# EAGLE design anemo5 (EAGLE 6.6.0)
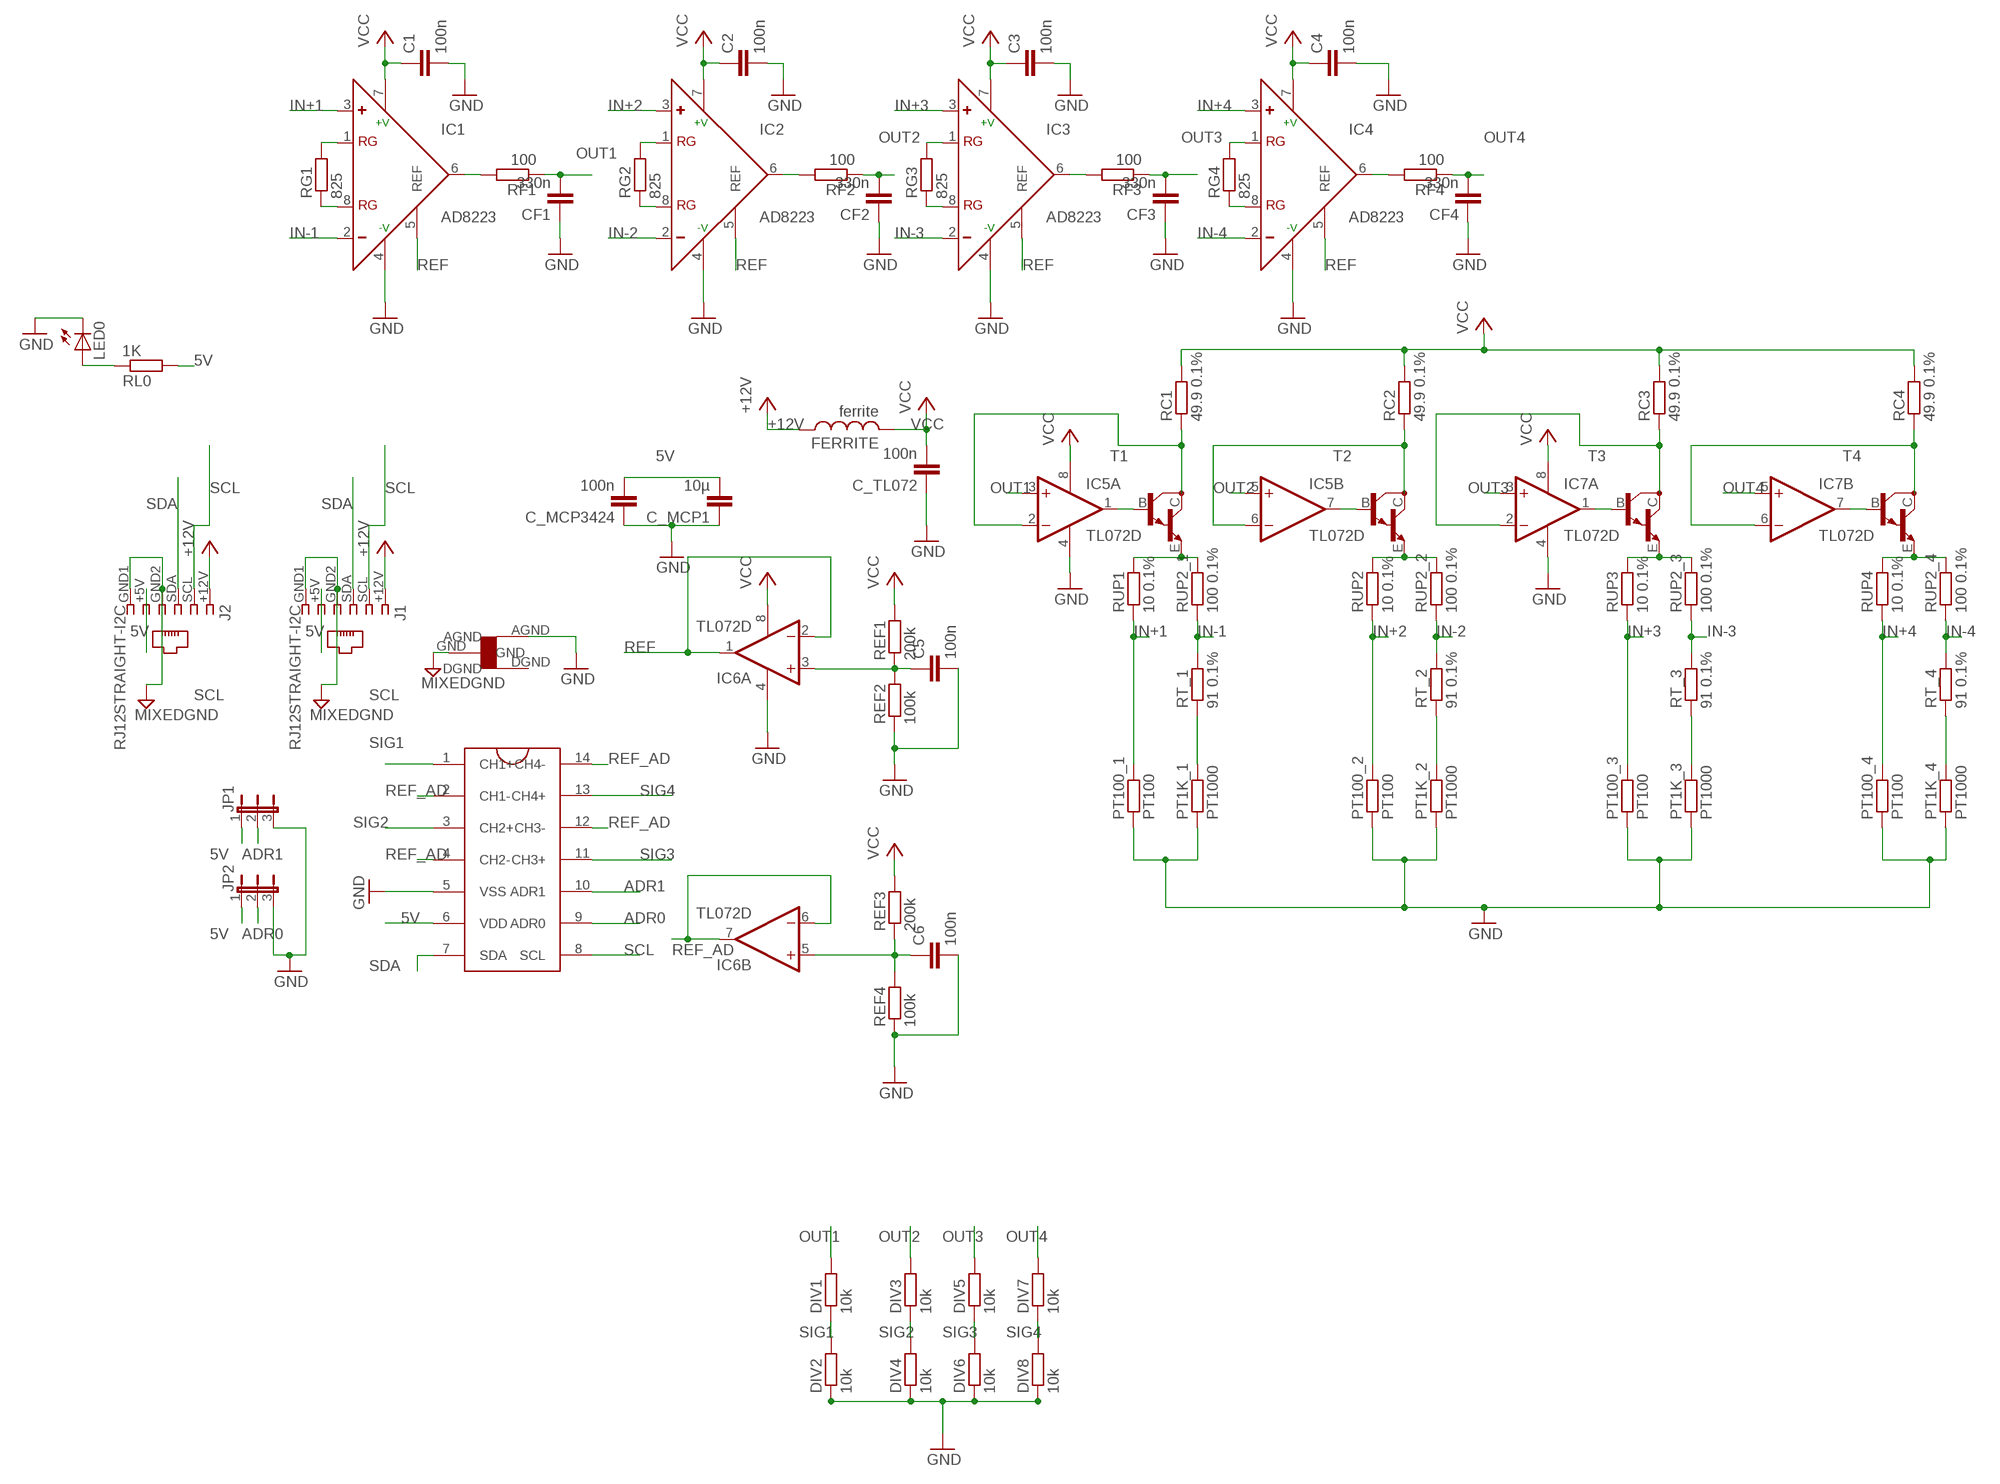
[diagram p0: schematic, sheet 1]

## Parts
C1  100n  C-EUC1206  [C1206]
C2  100n  C-EUC1206  [C1206]
C3  100n  C-EUC1206  [C1206]
C4  100n  C-EUC1206  [C1206]
C5  100n  C-EUC1206  [C1206]
C6  100n  C-EUC1206  [C1206]
C_MCP1  10µ  C-EUC1206  [C1206]
C_MCP3424  100n  C-EUC1206  [C1206]
C_TL072  100n  C-EUC1206  [C1206]
CF1  330n  C-EUC1206  [C1206]
CF2  330n  C-EUC1206  [C1206]
CF3  330n  C-EUC1206  [C1206]
CF4  330n  C-EUC1206  [C1206]
DIV1  10k  R-EU_M1206  [M1206]
DIV2  10k  R-EU_M1206  [M1206]
DIV3  10k  R-EU_M1206  [M1206]
DIV4  10k  R-EU_M1206  [M1206]
DIV5  10k  R-EU_M1206  [M1206]
DIV6  10k  R-EU_M1206  [M1206]
DIV7  10k  R-EU_M1206  [M1206]
DIV8  10k  R-EU_M1206  [M1206]
FERRITE  ferrite  L-USL3216C  [L3216C]
IC1  AD8223  AD620R  [SO8]
IC2  AD8223  AD620R  [SO8]
IC3  AD8223  AD620R  [SO8]
IC4  AD8223  AD620R  [SO8]
IC5  TL072D  [SO08]
IC6  TL072D  [SO08]
IC7  TL072D  [SO08]
J1  RJ12STRAIGHT-I2C  [RJ12-STRAIGHT-I2C]
J2  RJ12STRAIGHT-I2C  [RJ12-STRAIGHT-I2C]
JP1  JP2E  [JP2]
JP2  JP2E  [JP2]
LED0  LED1206  [LED-1206]
PT1K_1  PT1000  R-EU_M1206  [M1206]
PT1K_2  PT1000  R-EU_M1206  [M1206]
PT1K_3  PT1000  R-EU_M1206  [M1206]
PT1K_4  PT1000  R-EU_M1206  [M1206]
PT100_1  PT100  R-EU_M1206  [M1206]
PT100_2  PT100  R-EU_M1206  [M1206]
PT100_3  PT100  R-EU_M1206  [M1206]
PT100_4  PT100  R-EU_M1206  [M1206]
RC1  49.9 0.1%  R-EU_M1206  [M1206]
RC2  49.9 0.1%  R-EU_M1206  [M1206]
RC3  49.9 0.1%  R-EU_M1206  [M1206]
RC4  49.9 0.1%  R-EU_M1206  [M1206]
REF1  200k  R-EU_M1206  [M1206]
REF2  100k  R-EU_M1206  [M1206]
REF3  200k  R-EU_M1206  [M1206]
REF4  100k  R-EU_M1206  [M1206]
RF1  100  R-EU_M1206  [M1206]
RF2  100  R-EU_M1206  [M1206]
RF3  100  R-EU_M1206  [M1206]
RF4  100  R-EU_M1206  [M1206]
RG1  825  R-EU_M1206  [M1206]
RG2  825  R-EU_M1206  [M1206]
RG3  825  R-EU_M1206  [M1206]
RG4  825  R-EU_M1206  [M1206]
RL0  1K  R-EU_M1206  [M1206]
RT_1  91 0.1%  R-EU_M1206  [M1206]
RT_2  91 0.1%  R-EU_M1206  [M1206]
RT_3  91 0.1%  R-EU_M1206  [M1206]
RT_4  91 0.1%  R-EU_M1206  [M1206]
RUP1  10 0.1%  R-EU_M1206  [M1206]
RUP2  10 0.1%  R-EU_M1206  [M1206]
RUP2_1  100 0.1%  R-EU_M1206  [M1206]
RUP2_2  100 0.1%  R-EU_M1206  [M1206]
RUP2_3  100 0.1%  R-EU_M1206  [M1206]
RUP2_4  100 0.1%  R-EU_M1206  [M1206]
RUP3  10 0.1%  R-EU_M1206  [M1206]
RUP4  10 0.1%  R-EU_M1206  [M1206]
T1  MMBTA13LT1-NPN_DARL-SOT23-BEC  [SOT23-BEC]
T2  MMBTA13LT1-NPN_DARL-SOT23-BEC  [SOT23-BEC]
T3  MMBTA13LT1-NPN_DARL-SOT23-BEC  [SOT23-BEC]
T4  MMBTA13LT1-NPN_DARL-SOT23-BEC  [SOT23-BEC]
U$1  MCP3424(SO14)  [14LDSOIC]
U$2  STARGND  [STAR]

## Nets
5V: C_MCP1.2 C_MCP3424.2 J1.+5V J2.+5V JP1.1 JP2.1 RL0.2 U$1.6(VDD)
+12V: FERRITE.1 J1.+12V J2.+12V
ADR0: JP2.2 U$1.9(ADR0)
ADR1: JP1.2 U$1.10(ADR1)
GND [gnd]: C1.2 C2.2 C3.2 C4.2 C5.2 C6.2 C_MCP1.1 C_MCP3424.1 C_TL072.1 CF1.1 CF2.1 CF3.1 CF4.1 DIV2.1 DIV4.1 DIV6.1 DIV8.1 IC1.4(-V) IC2.4(-V) IC3.4(-V) IC4.4(-V) IC5.4(P:V-) IC6.4(P:V-) IC7.4(P:V-) JP1.3 JP2.3 LED0.C PT1K_1.1 PT1K_2.1 PT1K_3.1 PT1K_4.1 PT100_1.1 PT100_2.1 PT100_3.1 PT100_4.1 REF2.1 REF4.1 U$1.5(VSS) U$2.AGND
IN+1: IC1.3(+) PT100_1.2 RUP1.1
IN+2: IC2.3(+) PT100_2.2 RUP2.1
IN+3: IC3.3(+) PT100_3.2 RUP3.1
IN+4: IC4.3(+) PT100_4.2 RUP4.1
IN-1: IC1.2(-) RT_1.2 RUP2_1.1
IN-2: IC2.2(-) RT_2.2 RUP2_2.1
IN-3: IC3.2(-) RT_3.2 RUP2_3.1
IN-4: IC4.2(-) RT_4.2 RUP2_4.1
MIXEDGND [gnd]: J1.GND1 J1.GND2 J2.GND1 J2.GND2 U$2.GND
N$1: IC1.1(RG) RG1.2
N$2: IC1.8(RG) RG1.1
N$3: IC2.8(RG) RG2.1
N$4: IC2.1(RG) RG2.2
N$5: IC3.1(RG) RG3.2
N$6: IC3.8(RG) RG3.1
N$7: IC4.1(RG) RG4.2
N$8: IC4.8(RG) RG4.1
N$9: RUP1.2 RUP2_1.2 T1.E
N$10: C5.1 IC6.3(A:+IN) REF1.1 REF2.2
N$11: RUP2.2 RUP2_2.2 T2.E
N$12: RUP2_3.2 RUP3.2 T3.E
N$13: RUP2_4.2 RUP4.2 T4.E
N$14: LED0.A RL0.1
N$15 [highpower]: IC5.2(A:-IN) RC1.1 T1.C
N$16 [highpower]: IC5.6(B:-IN) RC2.1 T2.C
N$17 [highpower]: IC7.2(A:-IN) RC3.1 T3.C
N$18: IC1.6(OUT) RF1.2
N$19: IC2.6(OUT) RF2.2
N$20: IC3.6(OUT) RF3.2
N$21: IC4.6(OUT) RF4.2
N$22 [highpower]: IC7.6(B:-IN) RC4.1 T4.C
N$23: PT1K_1.2 RT_1.1
N$24: C6.1 IC6.5(B:+IN) REF3.1 REF4.2
N$25: PT1K_2.2 RT_2.1
N$27: PT1K_3.2 RT_3.1
N$29: PT1K_4.2 RT_4.1
OUT1: CF1.2 DIV1.2 IC5.3(A:+IN) RF1.1
OUT1A: IC5.1(A:OUT) T1.B
OUT2: CF2.2 DIV3.2 IC5.5(B:+IN) RF2.1
OUT2A: IC5.7(B:OUT) T2.B
OUT3: CF3.2 DIV5.2 IC7.3(A:+IN) RF3.1
OUT3A: IC7.1(A:OUT) T3.B
OUT4: CF4.2 DIV7.2 IC7.5(B:+IN) RF4.1
OUT4A: IC7.7(B:OUT) T4.B
REF: IC1.5(REF) IC2.5(REF) IC3.5(REF) IC4.5(REF) IC6.1(A:OUT) IC6.2(A:-IN)
REF_AD: IC6.6(B:-IN) IC6.7(B:OUT) U$1.2(CH1-) U$1.4(CH2-) U$1.12(CH3-) U$1.14(CH4-)
SCL: J1.SCL J2.SCL U$1.8(SCL)
SDA: J1.SDA J2.SDA U$1.7(SDA)
SIG1: DIV1.1 DIV2.2 U$1.1(CH1+)
SIG2: DIV3.1 DIV4.2 U$1.3(CH2+)
SIG3: DIV5.1 DIV6.2 U$1.11(CH3+)
SIG4: DIV7.1 DIV8.2 U$1.13(CH4+)
VCC [highpower]: C1.1 C2.1 C3.1 C4.1 C_TL072.2 FERRITE.2 IC1.7(+V) IC2.7(+V) IC3.7(+V) IC4.7(+V) IC5.8(P:V+) IC6.8(P:V+) IC7.8(P:V+) RC1.2 RC2.2 RC3.2 RC4.2 REF1.2 REF3.2
Unconnected: U$2.DGND

## Library data of the parts
C1-C6 C_MCP1 C_MCP3424 C_TL072 CF1-CF4 = rcl:C-EU: CAPACITOR, European symbol
DIV1-DIV8 PT1K_1-PT1K_4 PT100_1-PT100_4 RC1-RC4 REF1-REF4 RF1-RF4 RG1-RG4 RL0 RT_1-RT_4 RUP1 RUP2 RUP2_1-RUP2_4 RUP3 RUP4 = resistor:R-EU_: RESISTOR, European symbol
FERRITE = rcl:L-US: INDUCTOR, American symbol
IC1-IC4 = analog-devices:AD620: Low Cost, Low Power, Instrumentation Amplifier Source: http://www.analog.com/UploadedFiles/Data_Sheets/37793330023930AD620_e.pdf; MPN: AD620AR; OC_FARNELL: 1464424; OC_NEWARK: 05F7109
IC5-IC7 = linear:TL072: OP AMP
J1 J2 = lpatiny:RJ12: CORCOM Modular RJ Jacks No Shield Source: www.tycoelectronics.com .. ENG_DS_1654001_1099_RJ_L_0507.pdf
JP1 JP2 = jumper:JP2E: JUMPER
LED0 = SparkFun:LED: LEDs Standard schematic elements and footprints for 5mm, 3mm, 1206, and 0603 sized LEDs. 5mm - Spark Fun Electronics SKU : COM-00529 (and others)
T1-T4 = transistor:*-NPN_DARL-: NPN Darlington Transistor
U$1 = mcp3424:MCP3424(SO14)
U$2 = lpatiny:STARGND

## Net classes
0 default: width 0.61 mm
1 gnd: width 0.61 mm
2 highpower: width 0.813 mm

## Board
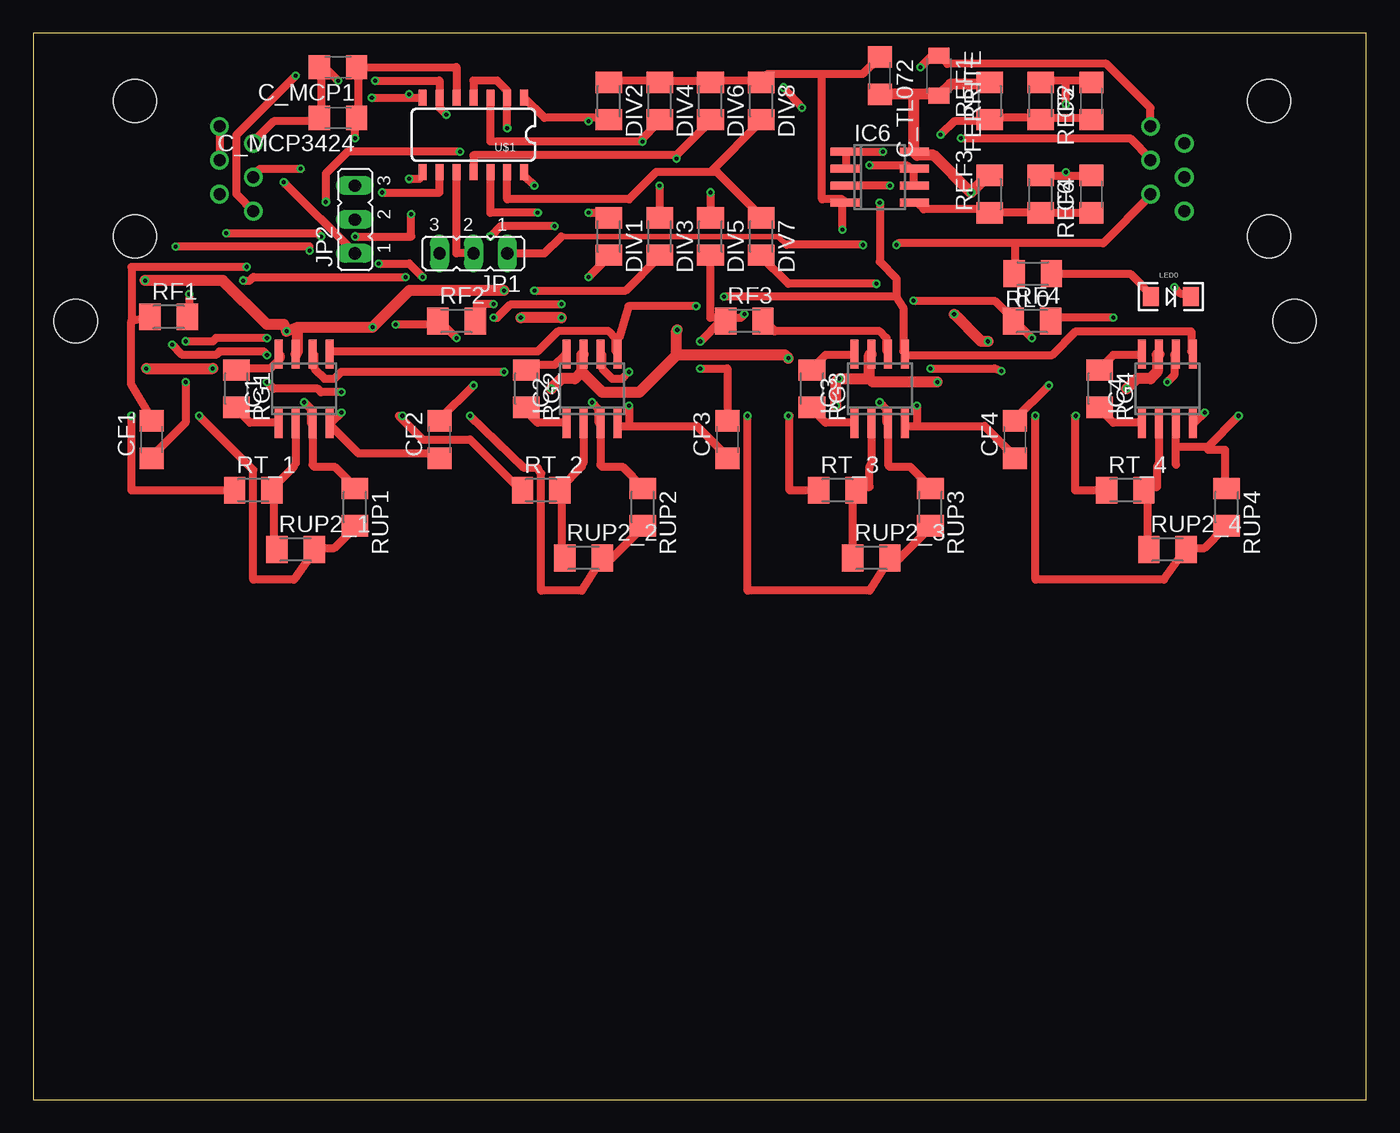
[diagram p1: board, top side]
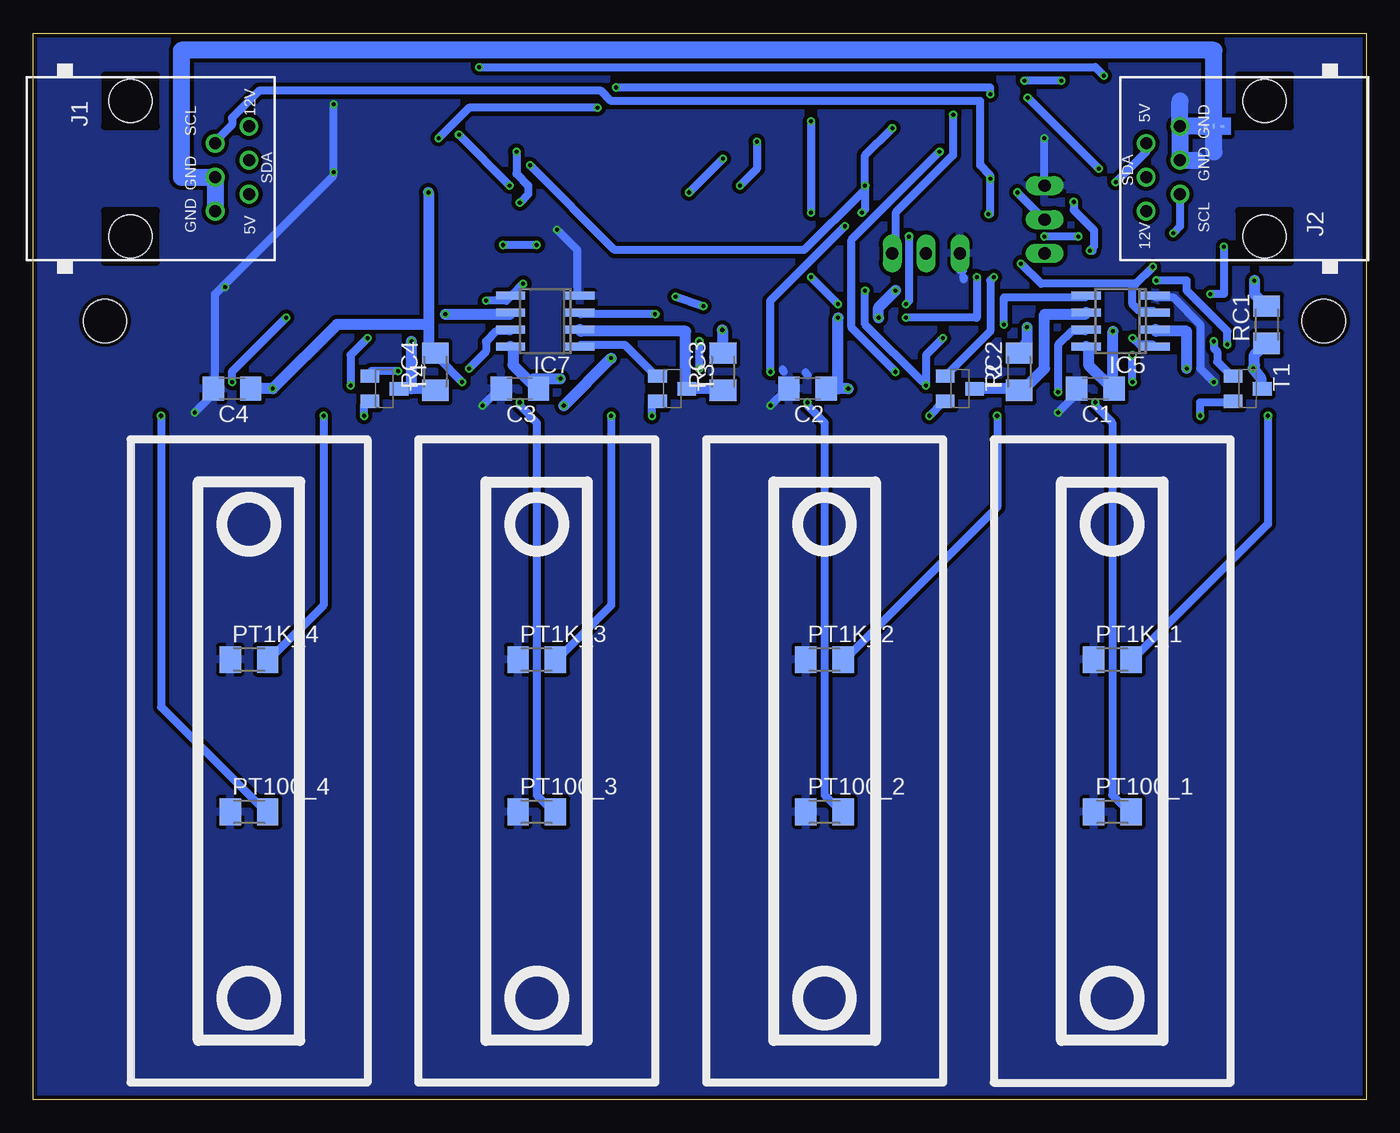
[diagram p2: board, bottom side, seen from below]

Size 100 x 80 mm. Coordinates in mm from the lower left corner, seen from the top.
Outline: 0,0 100,0 100,80 0,80 0,0
Copper layers (1*16): Top 0.035mm / dielectric 1.5mm / Bottom 0.035mm
Design rules "Fusion_eagle_rule_v1.1 *": minimum track width 6mil, minimum drill 12mil, track to track 10mil, track to pad 10mil, pad to pad 10mil, via to via 10mil, smd to smd 0mil, copper to edge 10mil, drill to drill 10mil, minimum pad ring 10mil, minimum via ring 6mil, stop-mask expansion 2mil, vias tented up to drill 100mil, thermal gap 10mil
Holes 3.25 mm at 3.17,58.42 94.61,58.42
vRestrict: area -2.5,-1.3 to 102.9,50.8

### Footprints (pad centres in the part's own frame; a part is rotated, then mirrored left to right if it is on the bottom)
C1206 = smd 1.6 x 1.8: 1 -1.4,0; 2 1.4,0
M1206 = smd 1.6 x 2: 1 -1.4,0; 2 1.4,0
L3216C = smd 1.2 x 1.6: 1 -1.5,0; 2 1.5,0
SO8 = smd 0.6 x 2.2: 1 -1.905,-2.6; 2 -0.635,-2.6; 3 0.635,-2.6; 4 1.905,-2.6; 5 1.905,2.6; 6 0.635,2.6; 7 -0.635,2.6; 8 -1.905,2.6
SO08 = smd 0.6 x 2.2: 1 -1.905,-2.6; 2 -0.635,-2.6; 3 0.635,-2.6; 4 1.905,-2.6; 5 1.905,2.6; 6 0.635,2.6; 7 -0.635,2.6; 8 -1.905,2.6
RJ12-STRAIGHT-I2C = drill 0.9 pad 1.4: +5V 1.905,8.89; +12V -3.175,8.89; GND1 3.175,6.35; GND2 0.635,6.35; SCL -1.905,6.35; SDA -0.635,8.89 | hole 3.251: -5.08,0; 5.08,0
JP2 = drill 0.914 long: 1 -2.54,0; 2 0,0; 3 2.54,0
LED-1206 = smd 1.2 x 1.4: A -1.5,0; C 1.5,0
SOT23-BEC = smd 1 x 1.4: B -0.95,-1.1; C 0,1.1; E 0.95,-1.1
14LDSOIC = smd 1.2 x 0.6: 1 -2.8,3.81; 2 -2.8,2.54; 3 -2.8,1.27; 4 -2.8,0; 5 -2.8,-1.27; 6 -2.8,-2.54; 7 -2.8,-3.81; 8 2.8,-3.81; 9 2.8,-2.54; 10 2.8,-1.27; 11 2.8,0; 12 2.8,1.27; 13 2.8,2.54; 14 2.8,3.81
STAR = smd 0.152 x 0.305: AGND 0.635,-0.635; DGND 0.635,0.635 | smd 0.305 x 0.152: GND 0.635,0

### Placement (x,y rotation side)
C1  20.32,53.34 180 bottom
C2  41.91,53.34 180 bottom
C3  63.5,53.34 180 bottom
C4  85.09,53.34 180 bottom
C5  79.38,74.93 90 top
C6  79.38,67.94 90 top
C_MCP1  22.86,77.47 180 top
C_MCP3424  22.86,73.66 180 top
C_TL072  63.5,76.83 270 top
CF1  8.89,49.53 90 top
CF2  30.48,49.53 90 top
CF3  52.07,49.53 90 top
CF4  73.66,49.53 90 top
DIV1  43.18,64.77 270 top
DIV2  43.18,74.93 270 top
DIV3  46.99,64.77 270 top
DIV4  46.99,74.93 270 top
DIV5  50.8,64.77 270 top
DIV6  50.8,74.93 270 top
DIV7  54.61,64.77 270 top
DIV8  54.61,74.93 270 top
FERRITE  67.94,76.83 270 top
IC1  20.32,53.34 0 top
IC2  41.91,53.34 0 top
IC3  63.5,53.34 0 top
IC4  85.09,53.34 0 top
IC5  18.41,58.42 90 bottom
IC6  63.5,69.22 270 top
IC7  61.59,58.42 90 bottom
J1  92.71,69.85 270 bottom
J2  7.62,69.85 90 bottom
JP1  33.02,63.5 180 top
JP2  24.13,66.04 90 top
LED0  85.34,60.25 0 top
PT1K_1  19.05,33.02 0 bottom
PT1K_2  40.64,33.02 0 bottom
PT1K_3  62.23,33.02 0 bottom
PT1K_4  83.82,33.02 0 bottom
PT100_1  19.05,21.59 0 bottom
PT100_2  40.64,21.59 0 bottom
PT100_3  62.23,21.59 0 bottom
PT100_4  83.82,21.59 0 bottom
RC1  7.47,58.14 90 bottom
RC2  26.04,54.61 90 bottom
RC3  48.26,54.61 90 bottom
RC4  69.85,54.61 90 bottom
REF1  71.75,74.93 90 top
REF2  75.56,74.93 270 top
REF3  71.75,67.94 90 top
REF4  75.56,67.94 270 top
RF1  10.16,58.72 0 top
RF2  31.75,58.42 0 top
RF3  53.34,58.42 0 top
RF4  74.93,58.42 0 top
RG1  15.24,53.34 270 top
RG2  36.98,53.34 270 top
RG3  58.42,53.34 270 top
RG4  80.01,53.34 270 top
RL0  74.98,61.98 180 top
RT_1  16.51,45.72 0 top
RT_2  38.1,45.72 0 top
RT_3  60.33,45.72 0 top
RT_4  81.92,45.72 0 top
RUP1  24.13,44.45 270 top
RUP2  45.72,44.45 270 top
RUP2_1  19.68,41.27 0 top
RUP2_2  41.27,40.64 0 top
RUP2_3  62.87,40.64 0 top
RUP2_4  85.09,41.27 0 top
RUP3  67.31,44.45 270 top
RUP4  89.53,44.45 270 top
T1  8.89,53.34 270 bottom
T2  30.48,53.34 270 bottom
T3  52.07,53.34 270 bottom
T4  73.66,53.34 270 bottom
U$1  33.02,72.39 270 top
U$2  11.43,73.66 270 bottom

### Tracks (layer width: path | path; a pad name or v marks a point on that pad's centre or on a via)
5V  (via drill 0.3)
  Top 0.406: 56.52,64.14 55.88,64.77 39.62,64.77
  Top 0.61: v25.65,76.45 30.48,76.45 U$1.6 30.48,74.42 v30.99,73.91 | v22.86,76.45 21.84,77.47 C_MCP1.2 21.59,77.22 21.59,73.66 C_MCP3424.2 21.34,73.41 18.03,73.41 16.51,71.88 J2.+5V | v18.8,68.83 JP2.1 | 39.62,64.77 38.35,63.5 JP1.1 | J1.+5V 83.82,67.82 80.26,64.26 73.66,64.26 | 73.66,64.26 64.9,64.26 v64.77,64.14 | v62.23,64.14 56.52,64.14 | 73.66,64.26 73.66,61.98 RL0.2
  Bottom 0.61: v22.86,76.45 v25.65,76.45 | v18.8,68.83 16.51,71.12 J2.+5V | JP1.1 35.31,63.75 35.31,66.55 30.99,70.87 v30.99,73.91 | v64.77,64.14 v62.23,64.14
+12V  (via drill 0.3)
  Top 0.61: J1.+12V 83.82,74.42 80.52,77.72 68.58,77.72 68.07,78.23 FERRITE.1 67.82,78.23 67.31,78.23 v66.55,77.47 | v19.68,76.83 15.24,72.39 15.24,67.94 J2.+12V
  Bottom 0.61: v66.55,77.47 20.32,77.47 v19.68,76.83
ADR0  (via drill 0.3)
  Top 0.61: U$1.9 30.48,68.07 v26.16,68.07
  Bottom 0.61: JP2.2 v26.16,68.07
ADR1
  Top 0.61: U$1.10 31.75,63.5 JP1.2
GND  (via drill 0.3)
  Top 0.61: DIV2.1 43.18,76.45 46.99,76.45 DIV4.1 47.24,76.45 50.8,76.45 DIV6.1 51.05,76.45 54.36,76.45 DIV8.1 54.61,76.45 55.12,76.96 59.18,76.96 | 59.18,76.96 62.23,76.96 C_TL072.1 | 66.29,50.55 65.53,50.55 IC3.4 | 66.29,50.55 71.37,50.55 73.66,48.26 CF4.1 | 44.7,50.55 43.94,50.55 IC2.4 | 44.7,50.55 49.78,50.55 52.07,48.26 CF3.1 | CF2.1 30.48,48.26 30.23,48.51 24.38,48.51 22.35,50.55 IC1.4 22.35,50.8 v23.11,51.56 | 77.47,76.45 79.25,76.45 C5.2 | 77.47,76.45 75.69,76.45 REF2.1 | 77.47,69.34 75.69,69.34 REF4.1 | 77.47,69.34 79.25,69.34 C6.2 | v77.47,74.68 77.47,76.45 | v77.47,69.6 77.47,69.34 | U$1.5 31.75,77.47 C_MCP1.1 24.38,77.22 24.38,73.66 C_MCP3424.1 24.13,73.41 v24.13,72.14 | v11.43,53.85 11.43,50.8 8.89,48.26 CF1.1 | v60.71,65.28 60.71,67.31 IC6.4 60.71,67.56 59.18,67.56 59.18,76.96 | v44.7,52.07 44.7,50.55 | v66.29,52.07 66.29,50.55 | v87.88,51.56 87.12,50.8 IC4.4 | v85.6,60.96 86.11,60.45 86.61,60.45 LED0.C
  Bottom 0.61: v77.47,74.68 v77.47,69.6 77.47,69.34 85.72,61.09 | v11.43,53.85 12.45,54.86 12.45,58.17 14.48,60.2 15.75,60.2 IC5.4 | v60.71,65.28 59.18,63.75 59.18,60.45 IC7.4 | JP2.3 v24.13,72.14 | 85.72,61.09 86.36,60.45 86.36,53.34 C4.2 86.61,53.09 86.61,52.83 v87.88,51.56 | v23.11,51.56 21.84,52.83 21.84,53.34 C1.2 | v44.7,52.07 43.43,53.34 C2.2 43.18,53.34 | v66.29,52.07 65.02,53.34 C3.2 | 41.91,54.36 42.06,54.58 | 43.69,54.61 43.79,54.8 | v85.6,60.96 85.72,61.09 | 30.48,62.74 JP1.3 30.23,62.23 30.48,62.23 | 30.23,61.72 30.2,61.55
  Bottom 1.27: 11.43,71.12 11.43,73.03 U$2.AGND 13.97,73.03 | 13.97,73.03 13.97,74.93 | 13.97,73.03 13.97,70.48 12.7,70.48
  pour Bottom (isolate 0.305): -0.03,80.01 99.69,80.01 99.69,0 0,-0.03
IN+1  (via drill 0.3)
  Top 0.61: v20.32,52.32 20.83,51.82 20.83,50.8 IC1.3 20.95,47.62 21.08,47.5 22.61,47.5 24.13,45.97 RUP1.1
  Bottom 0.61: v20.32,52.32 20.32,52.07 19.05,50.8 19.05,22.86 17.78,21.59 PT100_1.2
IN+2  (via drill 0.3)
  Top 0.61: v41.91,52.32 42.42,51.82 42.42,50.8 IC2.3 42.55,47.62 42.67,47.5 44.2,47.5 45.72,45.97 RUP2.1
  Bottom 0.61: v41.91,52.32 41.91,52.07 40.64,50.8 40.64,22.86 39.37,21.59 PT100_2.2
IN+3  (via drill 0.3)
  Top 0.61: v63.5,52.32 64.01,51.82 64.01,50.8 IC3.3 64.14,47.62 64.26,47.5 65.79,47.5 67.31,45.97 RUP3.1
  Bottom 0.61: v63.5,52.32 63.5,52.07 62.23,50.8 62.23,22.86 60.96,21.59 PT100_3.2
IN+4  (via drill 0.3)
  Top 0.61: 85.72,47.62 85.72,49.02 | 85.72,49.02 IC4.3 | 88.14,49.02 v90.42,51.31 | 85.72,49.02 88.14,49.02 | RUP4.1 89.41,45.97 89.41,48.77 88.14,48.77 88.14,49.02
  Bottom 0.61: v90.42,51.31 90.42,29.46 82.55,21.59 PT100_4.2
IN-1
  Top 0.61: IC1.2 19.68,47.76 19.56,47.5 18.03,45.97 RT_1.2 18.03,45.72 18.03,41.4 RUP2_1.1
IN-2
  Top 0.61: IC2.2 41.27,47.76 41.15,47.5 39.62,45.97 RT_2.2 39.62,45.72 39.62,40.64 RUP2_2.1
IN-3
  Top 0.61: IC3.2 62.87,47.76 62.74,47.5 62.74,45.97 61.72,45.97 RT_3.2 61.47,45.72 RUP2_3.1
IN-4
  Top 0.61: IC4.2 84.45,47.76 84.33,47.5 84.33,45.97 83.57,45.97 RT_4.2 83.57,45.72 83.57,41.4 RUP2_4.1
MIXEDGND
  Top 0.61: J2.GND1 J2.GND2
  Bottom 1.27: J1.GND1 J1.GND2 88.9,69.22 88.9,78.74 11.43,78.74 U$2.GND J2.GND1 J2.GND2
N$1
  Top 0.61: RG1.2 15.24,51.82 16.26,50.8 18.29,50.8 IC1.1
N$2
  Top 0.61: RG1.1 15.24,54.86 17.78,54.86 18.54,55.63 18.54,55.88 IC1.8
N$3
  Top 0.61: RG2.1 36.83,54.86 37.08,55.12 39.12,55.12 39.88,55.88 IC2.8
N$4
  Top 0.61: RG2.2 36.83,51.82 37.85,50.8 39.88,50.8 IC2.1
N$5
  Top 0.61: RG3.2 58.42,51.82 59.44,50.8 61.47,50.8 IC3.1
N$6
  Top 0.61: RG3.1 58.42,54.86 59.44,55.88 61.47,55.88 IC3.8
N$7
  Top 0.61: RG4.2 80.01,51.82 81.03,50.8 83.06,50.8 IC4.1
N$8
  Top 0.61: RG4.1 80.01,54.86 81.03,55.88 83.06,55.88 IC4.8
N$9  (via drill 0.3)
  Top 0.61: v12.45,51.31 16.51,47.24 16.51,39.01 19.56,39.01 21.08,41.15 RUP2_1.2 21.34,41.4 22.61,41.4 24.13,42.93 RUP1.2
  Bottom 0.61: v12.45,51.31 12.45,52.32 10.16,52.32 T1.E
N$10  (via drill 0.3)
  Top 0.61: C5.1 79.25,73.66 75.69,73.66 REF2.2 75.44,73.66 71.88,73.66 REF1.1 71.63,73.41 69.09,73.41 v68.07,72.39 | v64.26,68.58 IC6.3
  Bottom 0.61: v68.07,72.39 v64.26,68.58
N$11  (via drill 0.3)
  Top 0.61: v32.77,51.31 36.83,47.4 37.85,47.4 38.1,46.99 38.1,38.2 41.15,38.2 RUP2_2.2 43.43,40.64 45.72,42.93 RUP2.2
  Bottom 0.61: v32.77,51.31 31.75,52.32 T2.E
N$12  (via drill 0.3)
  Top 0.61: v53.59,51.31 53.59,38.2 62.74,38.2 RUP2_3.2 65.02,40.64 67.31,42.93 RUP3.2
  Bottom 0.61: v53.59,51.31 53.59,52.07 53.34,52.32 T3.E
N$13  (via drill 0.3)
  Top 0.61: v75.18,51.31 75.18,39.01 84.84,39.01 86.36,41.15 RUP2_4.2 86.61,41.4 87.88,41.4 89.41,42.93 RUP4.2
  Bottom 0.61: v75.18,51.31 75.18,52.07 74.93,52.32 T4.E
N$14
  Top 0.61: RL0.1 82.3,61.98 83.82,60.45 LED0.A
N$15  (via drill 0.3)
  Top 0.813: v8.48,54.86 v13.46,54.86
  Bottom 0.813: v13.46,54.86 13.46,57.66 15.75,57.66 IC5.2 | T1.C 7.87,53.59 7.87,54.1 v8.48,54.86 8.38,55.12 8.38,55.88 7.62,56.64 RC1.1
N$16
  Bottom 0.813: T2.C 26.16,53.34 RC2.1 25.65,53.34 24.13,54.86 24.13,58.93 21.08,58.93 IC5.6
N$17
  Bottom 0.813: RC3.1 48.26,53.34 T3.C 51.05,53.59 51.05,57.66 58.93,57.66 IC7.2
N$18  (via drill 0.3)
  Top 0.61: v11.68,60.45 11.68,58.42 RF1.2 | v32,71.12 23.57,71.12 21.95,69.49 v21.95,67.36 | v35.31,54.61 23.11,54.61 22.61,54.1 21.84,54.1 21.08,54.86 21.08,55.88 IC1.6 | v20.73,63.7 20.73,64.01 v10.67,64.01
  Bottom 0.61: v32,71.12 38.61,64.52 38.61,57.91 v35.31,54.61 | 20.52,63.7 v20.73,63.7 20.42,64.01 20.42,65.23 21.95,66.75 v21.95,67.36 | v10.67,64.01 10.67,60.45 v11.68,60.45
N$19  (via drill 0.3)
  Top 0.61: v34.54,59.69 33.27,59.69 33.27,58.42 RF2.2 | v34.29,64.77 35.05,65.53 v39.12,65.53 | v44.7,54.61 44.2,54.1 43.43,54.1 42.67,54.86 42.67,55.88 IC2.6
  Bottom 0.61: v34.54,59.69 34.29,59.94 v34.29,64.77 | v39.12,65.53 44.7,59.94 v44.7,54.61
N$20
  Top 0.61: RF3.2 54.86,58.42 55.63,57.66 63.5,57.66 64.01,57.15 64.01,56.13 IC3.6
N$21  (via drill 0.3)
  Top 0.61: v81.03,58.67 76.71,58.67 76.45,58.42 RF4.2 | v85.09,53.85 85.6,54.36 85.6,55.88 IC4.6
  Bottom 0.61: v81.03,58.67 85.09,54.61 v85.09,53.85
N$22  (via drill 0.3)
  Top 0.813: v69.09,58.93 71.12,56.9 v71.63,56.9
  Bottom 0.406: 64.26,58.93 IC7.6
  Bottom 0.813: 71.63,53.34 69.85,53.34 RC4.1 | 71.63,53.34 T4.C | v69.09,58.93 64.26,58.93 | 71.63,53.34 v71.63,56.9
N$23  (via drill 0.3)
  Top 0.61: v7.37,51.31 7.37,45.72 RT_1.1
  Bottom 0.61: v7.37,51.31 7.37,43.18 17.53,33.02 PT1K_1.2
N$24
  Top 0.61: C6.1 79.25,66.55 75.69,66.55 REF4.2 75.44,66.55 71.88,66.55 REF3.1 71.63,66.8 66.8,66.8 66.29,67.31 IC6.5
N$25  (via drill 0.3)
  Top 0.61: 27.43,51.31 27.56,51.18 | 27.56,51.18 29.21,49.53 32.77,49.53 36.58,45.72 RT_2.1 | v27.69,51.31 27.56,51.18
  Bottom 0.61: v27.69,51.31 27.69,44.45 39.12,33.02 PT1K_2.2
N$27  (via drill 0.3)
  Top 0.61: RT_3.1 56.74,45.72 56.74,51.31 v56.64,51.31
  Bottom 0.61: v56.64,51.31 56.64,37.08 60.71,33.02 PT1K_3.2
N$29  (via drill 0.3)
  Top 0.61: RT_4.1 78.18,45.72 78.18,51.31 v78.23,51.31
  Bottom 0.61: v78.23,51.31 78.23,37.08 82.3,33.02 PT1K_4.2
OUT1  (via drill 0.3)
  Top 0.61: RF1.1 7.37,58.42 | 7.37,58.42 7.32,58.27 7.32,53.7 8.89,51.05 CF1.2 | v41.66,61.72 43.18,63.25 DIV1.2 | v39.62,59.69 35.81,59.69 34.8,58.67 v34.54,58.67 | v29.21,61.72 28.19,62.74 v25.91,62.74 | 7.37,58.42 7.37,62.48 v16,62.48
  Bottom 0.61: v39.62,59.69 v41.66,61.72 | v34.54,58.67 29.21,58.67 v29.21,61.72 | v25.91,62.74 24.38,61.21 17.53,61.21 | 17.53,61.21 17.53,59.69 17.02,59.18 16,59.18 IC5.3 | v16,62.48 17.27,61.21 17.53,61.21
OUT1A  (via drill 0.3)
  Top 0.61: v11.43,56.9 13.46,56.9 13.72,57.15 v17.53,57.15
  Bottom 0.61: v11.43,56.9 11.43,56.39 11.18,56.13 11.18,55.37 10.16,54.36 T1.B | v17.53,57.15 17.02,56.64 16,56.64 IC5.1
OUT2  (via drill 0.3)
  Top 0.61: v33.02,53.59 30.48,51.05 CF2.2 | v31.75,57.15 30.48,58.42 RF2.1 30.23,58.17 v27.18,58.17 | v37.59,60.71 44.45,60.71 46.99,63.25 DIV3.2
  Bottom 0.61: 33.02,53.85 33.02,55.88 v31.75,57.15 | 33.02,53.85 v33.02,53.59 | v37.59,60.71 37.59,58.17 33.27,53.85 33.02,53.85 | v27.18,58.17 27.18,60.2 21.08,60.2 IC5.5
OUT2A  (via drill 0.3)
  Top 0.61: v27.94,61.72 16.51,61.72 16.26,61.47 v15.75,61.47 | v10.41,56.64 11.18,55.88 13.72,55.88 13.97,56.13 17.27,56.13 v17.53,55.88 | v17.53,53.85 18.03,53.34 21.34,53.34 21.59,53.09 v23.11,53.09
  Bottom 0.61: v27.94,61.72 28.19,61.47 28.19,57.66 31.5,54.36 T2.B | v15.75,61.47 13.46,61.47 13.46,60.71 10.41,57.66 v10.41,56.64 | v17.53,53.85 v17.53,55.88 | v23.11,53.09 23.11,56.64 22.1,57.66 21.08,57.66 IC5.7
OUT3  (via drill 0.3)
  Top 0.61: CF3.2 52.07,54.86 v50.04,54.86 | v50.04,56.9 51.56,58.42 RF3.1 | DIV5.2 50.8,58.67 51.56,58.67 RF3.1 | v53.34,58.93 53.09,58.67 52.07,58.67 RF3.1
  Bottom 0.61: v50.04,56.9 v50.04,54.86 | v53.34,58.93 58.93,58.93 IC7.3
OUT3A
  Bottom 0.61: T3.B 53.34,54.36 55.63,56.64 58.93,56.64 IC7.1
OUT4  (via drill 0.3)
  Top 0.61: v76.2,53.59 73.66,51.05 CF4.2 | v74.93,57.15 73.66,58.42 RF4.1 73.41,58.67 72.14,59.94 v66.04,59.94 | v63.25,61.21 56.64,61.21 54.61,63.25 DIV7.2
  Bottom 0.61: v76.2,53.59 76.2,55.88 v74.93,57.15 | v63.25,61.21 64.01,60.45 IC7.5 64.26,60.2 64.52,59.94 v66.04,59.94
OUT4A  (via drill 0.3)
  Top 0.61: v72.64,54.66 72.14,54.86 v67.31,54.86
  Bottom 0.61: v72.64,54.66 74.68,54.66 T4.B | v67.31,54.86 66.04,56.13 66.04,56.9 65.28,57.66 64.26,57.66 IC7.7
REF  (via drill 0.3)
  Top 0.61: 43.69,57.15 43.18,57.66 39.37,57.66 37.85,56.13 22.35,56.13 IC1.5 | 43.69,57.15 43.69,56.13 IC2.5 | IC6.2 60.96,69.85 60.96,71.12 IC6.1 v63.75,71.12 | IC4.5 86.87,56.13 86.87,57.66 78.23,57.66 76.45,55.88 65.53,55.88 IC3.5 65.28,56.13 65.28,59.44 64.77,60.25 | v49.73,59.54 44.65,59.54 43.94,57.15 43.69,57.15 | 64.77,60.25 v51.82,60.25 | v63.5,67.31 63.5,62.87 64.77,61.59 64.77,60.25
  Bottom 0.61: v63.75,71.12 63.75,69.47 62.87,68.58 62.87,67.94 v63.5,67.31 | v51.82,60.25 v49.73,59.54
REF_AD  (via drill 0.3)
  Top 0.61: IC6.6 66.04,68.58 66.04,69.85 IC6.7 65.79,69.85 65.53,70.1 v62.74,70.1 | U$1.4 33.02,76.45 34.8,76.45 35.56,75.69 U$1.2 v35.56,72.9 | U$1.12 34.29,66.55 v37.85,66.55 | v37.59,68.58 36.83,69.34 U$1.14
  Bottom 0.61: v37.85,66.55 37.59,66.8 37.59,68.07 | 37.59,68.07 v37.59,68.58 37.59,70.87 v35.56,72.9 | v62.74,70.1 56.39,63.75 42.16,63.75 37.85,68.07 37.59,68.07
SCL  (via drill 0.3)
  Top 0.61: v28.19,69.09 28.96,69.09 29.21,69.34 U$1.8 | v21.59,64.77 21.34,65.02 v14.48,65.02 | v24.13,64.77 28.35,64.77 v28.35,66.45
  Bottom 0.61: v21.59,64.77 v24.13,64.77 | v14.48,65.02 13.97,65.53 J2.SCL | J1.SCL 86.36,71.88 85.09,73.15 85.09,73.66 83.06,75.69 57.4,75.69 56.64,74.93 28.96,74.93 28.96,70.1 28.19,69.34 v28.19,69.09 28.19,66.45 v28.35,66.45
SDA  (via drill 0.3)
  Top 0.61: v25.4,75.18 28.19,75.18 | 28.19,75.18 U$1.7 | v20.07,69.85 17.02,69.85 16.51,69.34 J2.SDA | v69.6,72.14 82.3,72.14 83.82,70.61 J1.SDA | v56.29,75.95 v57.66,74.42 | v28.19,75.44 28.19,75.18
  Bottom 0.61: v20.07,69.85 v25.4,75.18 | v69.6,72.14 67.31,74.42 v57.66,74.42 | v56.29,75.95 28.19,75.95 v28.19,75.44
SIG1  (via drill 0.3)
  Top 0.61: 41.66,73.66 43.18,73.66 DIV2.2 | 41.66,73.66 38.35,73.66 U$1.1 | v41.66,66.55 42.93,66.55 43.18,66.29 DIV1.1 | v41.66,73.41 41.66,73.66
  Bottom 0.61: v41.66,73.41 v41.66,66.55
SIG2  (via drill 0.3)
  Top 0.61: U$1.3 34.29,71.88 45.47,71.88 | 45.47,71.88 46.99,73.41 DIV4.2 | v46.99,68.58 DIV3.1 | v45.72,71.88 45.47,71.88
  Bottom 0.61: v46.99,68.58 45.72,69.85 v45.72,71.88
SIG3  (via drill 0.3)
  Top 0.61: U$1.11 33.02,70.87 48.26,70.87 | 48.26,70.87 50.8,73.41 DIV6.2 | v50.8,68.07 DIV5.1 | v48.26,70.61 48.26,70.87
  Bottom 0.61: v48.26,70.61 v50.8,68.07
SIG4
  Top 0.61: U$1.13 35.56,67.56 44.7,67.56 46.74,69.6 50.8,69.6 | 50.8,69.6 54.61,73.41 DIV8.2 | DIV7.1 54.61,66.29 51.31,69.6 50.8,69.6
VCC  (via drill 0.3)
  Top 0.813: 19.81,57.96 v19,57.66 18.8,58.17 17.53,58.17 14.22,61.47 v8.38,61.47 | 19.81,57.96 v25.45,57.96 28.19,60.71 v35.31,60.71 | 19.81,57.96 19.81,56.13 IC1.7 | REF1.2 71.63,76.2 68.83,76.2 68.07,75.44 FERRITE.2 67.56,75.44 66.04,75.44 | 66.04,75.44 C_TL072.2 | 66.04,75.44 66.04,71.12 IC6.8 66.29,70.87 67.56,70.87 v70.36,68.07 71.63,69.34 REF3.2 | v38.86,53.34 39.62,54.1 40.64,54.1 41.15,54.61 | 41.15,54.61 41.15,55.88 IC2.7 | 41.15,54.61 42.67,53.09 45.47,53.09 48.26,55.88 | 62.74,54.1 62.74,55.88 IC3.7 | 62.74,54.1 v60.45,54.1 60.2,53.85 v60.2,52.07 | v82.04,53.34 82.8,54.1 83.82,54.1 84.33,54.61 84.33,55.88 IC4.7 | v67.82,53.85 62.99,53.85 62.74,54.1 | 48.26,55.88 56.39,55.88 v56.64,55.63 | v39.62,58.67 v36.58,58.67 | 48.26,55.88 48.26,57.71 v48.31,57.76
  Bottom 0.61: 69.6,55.63 v67.82,53.85
  Bottom 0.813: IC5.8 20.83,56.39 20.83,55.12 19.05,53.34 C1.1 19,54.1 v19,57.66 | v25.45,57.96 25.45,56.9 25.91,56.13 RC2.2 | v38.86,53.34 39.62,53.34 | 39.62,53.34 C2.1 | RC3.2 48.26,55.88 48.46,55.88 48.31,56.03 v48.31,57.76 | IC7.8 64.01,56.39 64.01,55.12 62.23,53.34 C3.1 62.48,54.1 v60.45,54.1 | C4.1 v82.04,53.34 77.22,58.17 70.36,58.17 | v70.36,68.07 70.36,58.17 | 70.36,58.17 70.36,56.64 69.85,56.13 RC4.2 69.6,55.88 69.6,55.63 | v60.2,52.07 v56.64,55.63 | v35.31,60.71 36.58,59.44 v36.58,58.67 | 39.62,53.34 v39.62,58.67 | v8.38,61.47 8.38,60.45 7.62,59.69 RC1.2

### Text on the board
tValues: Anemometer v5